# EAGLE design master (EAGLE 5.11)
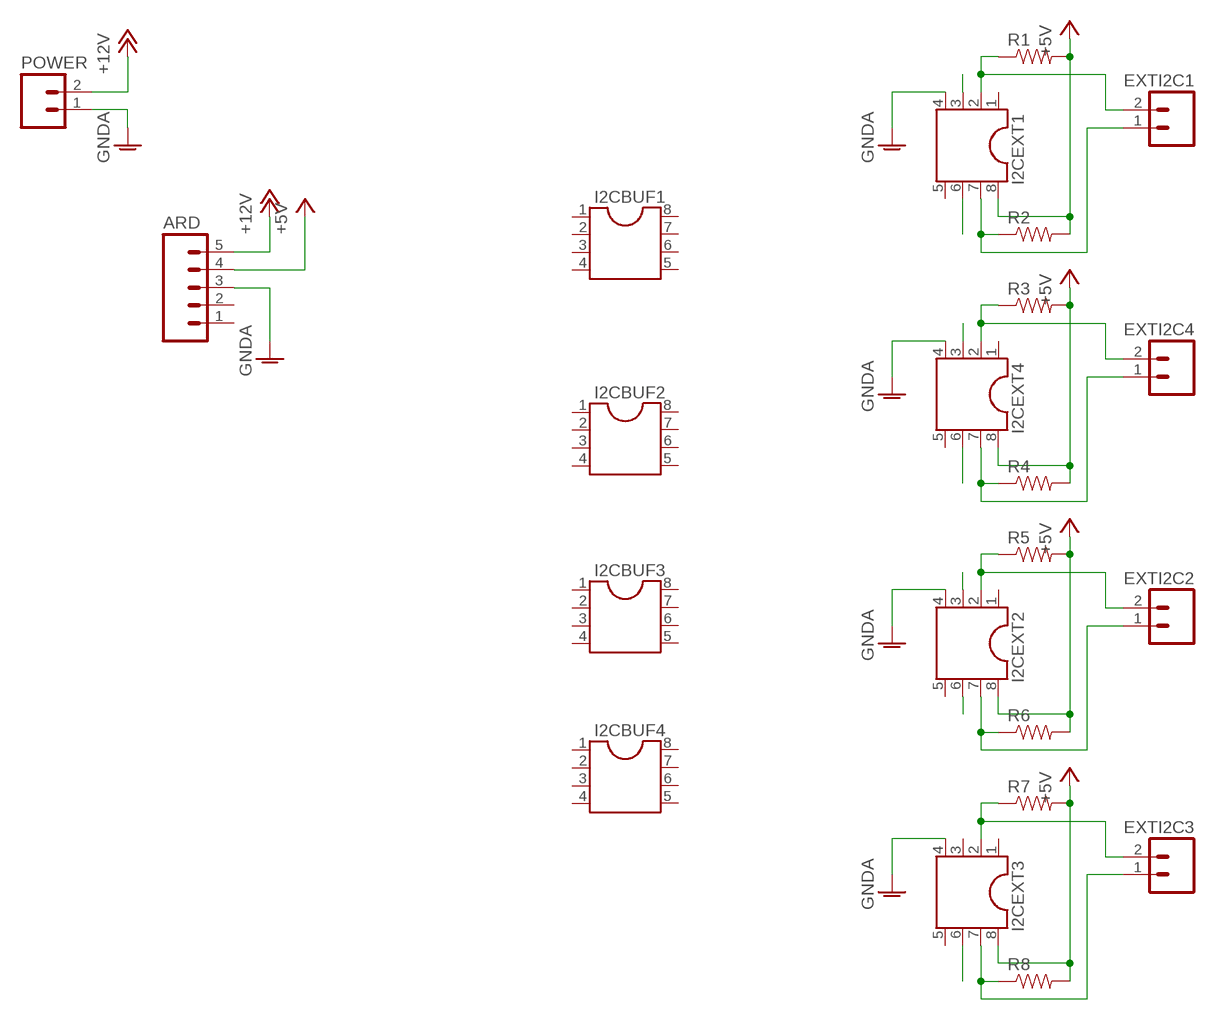
[diagram p0: schematic, sheet 1]

## Parts
ARD  M05LOCK  [1X05_LOCK]
EXTI2C1  M02LOCK  [1X02_LOCK]
EXTI2C2  M02LOCK  [1X02_LOCK]
EXTI2C3  M02LOCK  [1X02_LOCK]
EXTI2C4  M02LOCK  [1X02_LOCK]
I2CBUF1  DIL8  [DIL08]
I2CBUF2  DIL8  [DIL08]
I2CBUF3  DIL8  [DIL08]
I2CBUF4  DIL8  [DIL08]
I2CEXT1  DIL8  [DIL08]
I2CEXT2  DIL8  [DIL08]
I2CEXT3  DIL8  [DIL08]
I2CEXT4  DIL8  [DIL08]
POWER  M02PTH4  [1X02_XTRA_BIG]
R1  RESISTORAXIAL-0.3  [AXIAL-0.3]
R2  RESISTORAXIAL-0.3  [AXIAL-0.3]
R3  RESISTORAXIAL-0.3  [AXIAL-0.3]
R4  RESISTORAXIAL-0.3  [AXIAL-0.3]
R5  RESISTORAXIAL-0.3  [AXIAL-0.3]
R6  RESISTORAXIAL-0.3  [AXIAL-0.3]
R7  RESISTORAXIAL-0.3  [AXIAL-0.3]
R8  RESISTORAXIAL-0.3  [AXIAL-0.3]

## Nets
+5V: ARD.4 I2CEXT1.8 I2CEXT2.8 I2CEXT3.8 I2CEXT4.8 R1.P$2 R2.P$2 R3.P$2 R4.P$2 R5.P$2 R6.P$2 R7.P$2 R8.P$2
+12V: ARD.5 POWER.2
GNDA: ARD.3 I2CEXT1.4 I2CEXT2.4 I2CEXT3.4 I2CEXT4.4 POWER.1
N$1: EXTI2C2.2 I2CEXT2.2 R5.P$1
N$2: EXTI2C2.1 I2CEXT2.7 R6.P$1
N$3: EXTI2C1.2 I2CEXT1.2 R1.P$1
N$4: EXTI2C1.1 I2CEXT1.7 R2.P$1
N$5: EXTI2C4.2 I2CEXT4.2 R3.P$1
N$6: EXTI2C4.1 I2CEXT4.7 R4.P$1
N$7: EXTI2C3.2 I2CEXT3.2 R7.P$1
N$8: EXTI2C3.1 I2CEXT3.7 R8.P$1
N$11: I2CEXT1.6
N$12: I2CEXT1.3
N$13: I2CEXT4.6
N$14: I2CEXT4.3
N$15: I2CEXT2.3
N$16: I2CEXT2.6
N$17: I2CEXT3.6
Unconnected: ARD.1 ARD.2 I2CBUF1.1 I2CBUF1.2 I2CBUF1.3 I2CBUF1.4 I2CBUF1.5 I2CBUF1.6 I2CBUF1.7 I2CBUF1.8 I2CBUF2.1 I2CBUF2.2 I2CBUF2.3 I2CBUF2.4 I2CBUF2.5 I2CBUF2.6 I2CBUF2.7 I2CBUF2.8 I2CBUF3.1 I2CBUF3.2 I2CBUF3.3 I2CBUF3.4 I2CBUF3.5 I2CBUF3.6 I2CBUF3.7 I2CBUF3.8 I2CBUF4.1 I2CBUF4.2 I2CBUF4.3 I2CBUF4.4 I2CBUF4.5 I2CBUF4.6 I2CBUF4.7 I2CBUF4.8 I2CEXT1.1 I2CEXT1.5 I2CEXT2.1 I2CEXT2.5 I2CEXT3.1 I2CEXT3.3 I2CEXT3.5 I2CEXT4.1 I2CEXT4.5

## Library data of the parts
ARD = SparkFun:M05: Header 5 Standard 5-pin 0.1" header. Use with straight break away headers (SKU : PRT-00116), right angle break away headers (PRT-00553), swiss pins (PRT-00743), machine pins (PRT-00117), and female headers (PRT-00115). Molex polarized connector foot print use with SKU : PRT-08230 with associated crimp pins and housings.
EXTI2C1-EXTI2C4 POWER = SparkFun:M02: Header 2 Standard 2-pin 0.1" header. Use with straight break away headers (SKU : PRT-00116), right angle break away headers (PRT-00553), swiss pins (PRT-00743), machine pins (PRT-00117), and female headers (PRT-00115). Molex polarized connector foot print use with SKU : PRT-08233 with associated crimp pins and housings.
I2CBUF1-I2CBUF4 I2CEXT1-I2CEXT4 = ic-package:DIL8: Dual In Line / Socket
R1-R8 = SparkFun:RESISTOR: Resistor Basic schematic elements and footprints for 0603, 1206, and PTH resistors.

## Board
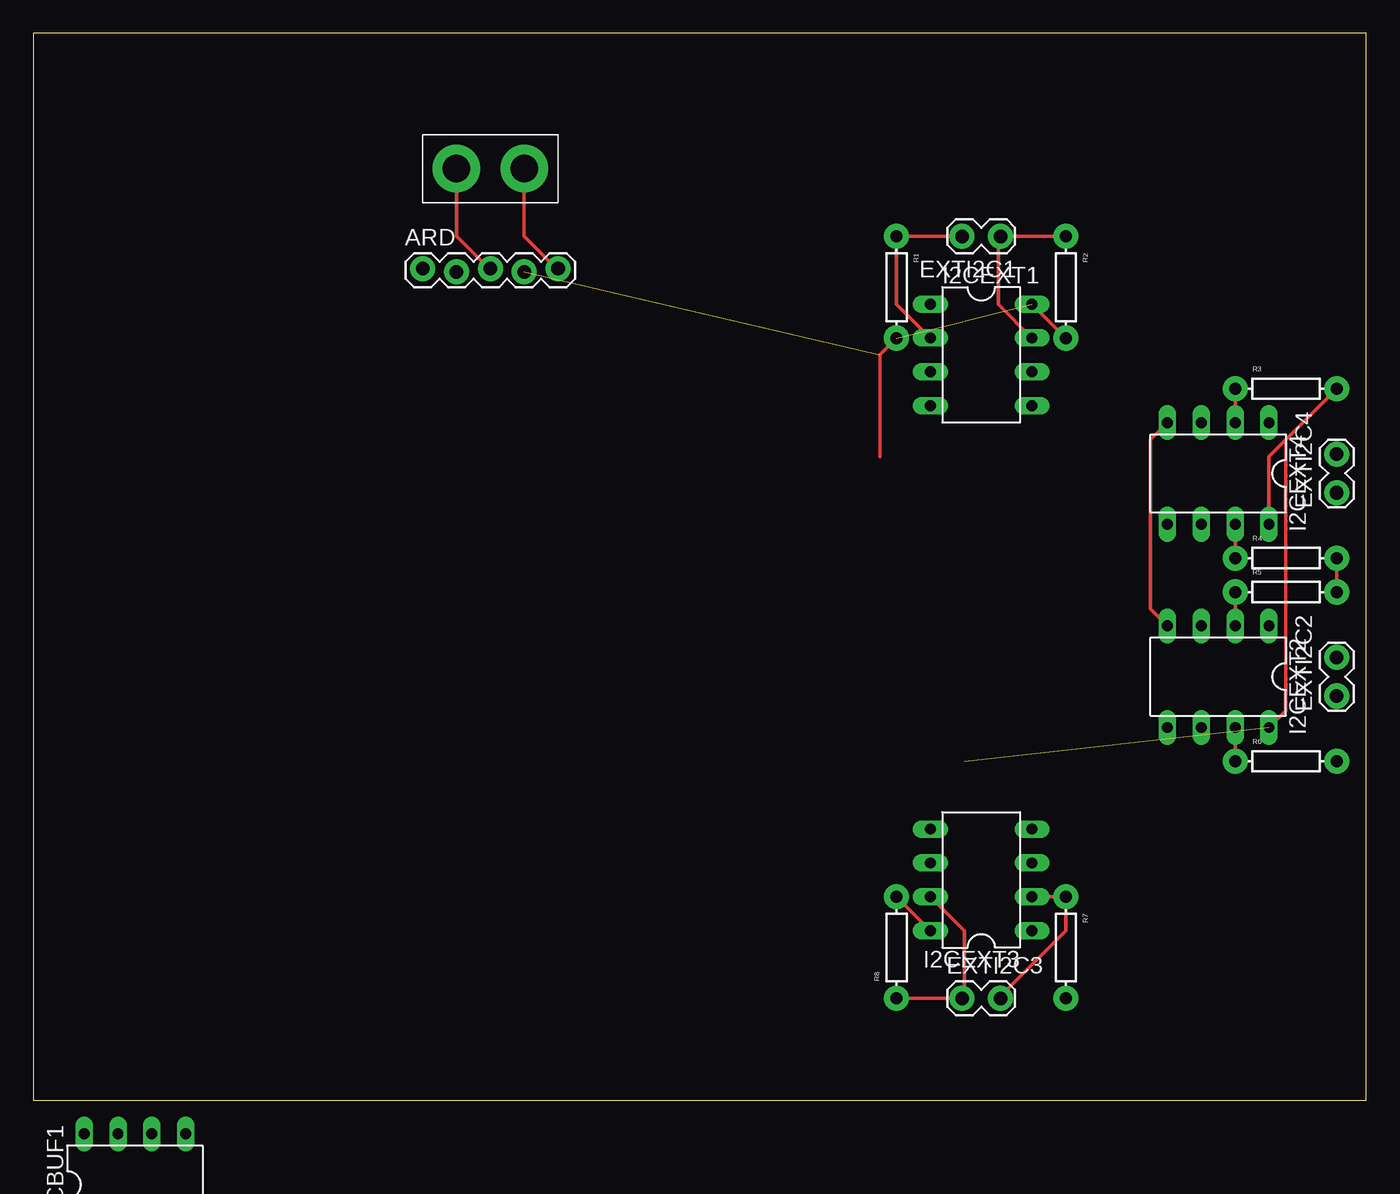
[diagram p1: board, top side]
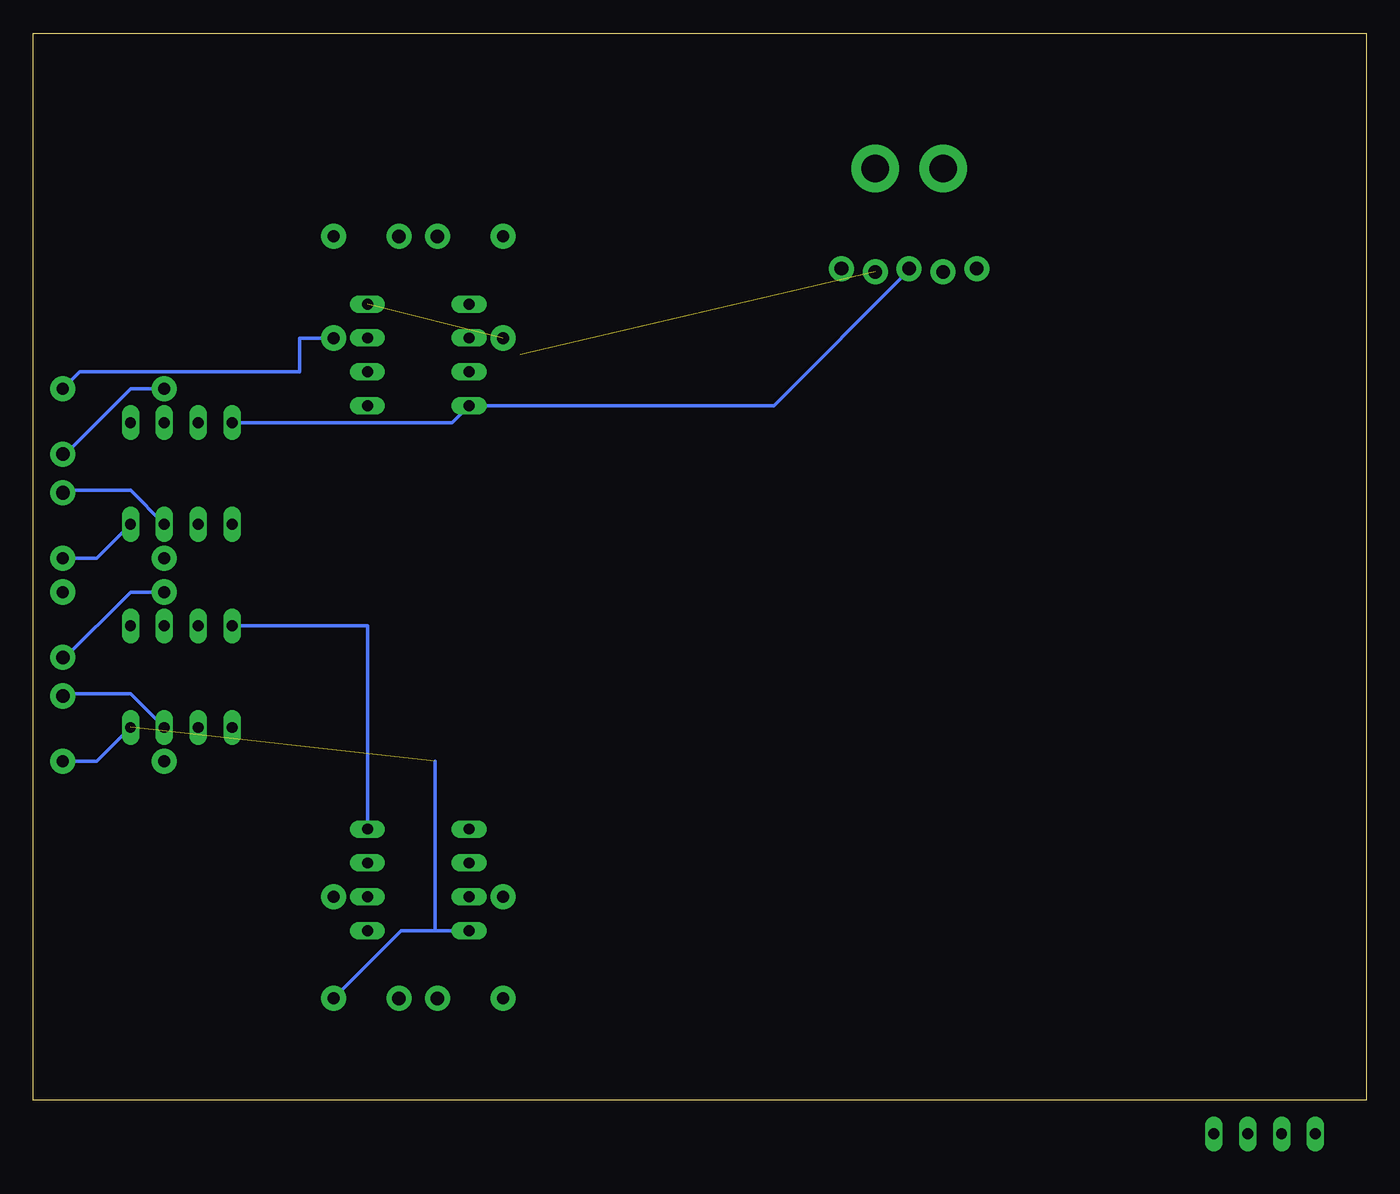
[diagram p2: board, bottom side, seen from below]

Size 100 x 80 mm. Coordinates in mm from the lower left corner, seen from the top.
Outline: 0,0 100,0 100,80 0,80 0,0
Copper layers (1*16): Top 0.035mm / dielectric 1.5mm / Bottom 0.035mm
Design rules "default": minimum track width 10mil, minimum drill 24mil, track to track 8mil, track to pad 8mil, pad to pad 8mil, via to via 8mil, smd to smd 8mil, copper to edge 40mil, drill to drill 8mil, minimum pad ring 10mil, minimum via ring 8mil, stop-mask expansion 4mil, vias tented up to drill 0mil, thermal gap 10mil

### Footprints (pad centres in the part's own frame; a part is rotated, then mirrored left to right if it is on the bottom)
1X05_LOCK = drill 1.016 pad 1.88 round: 1 0,0.127; 2 2.54,-0.127; 3 5.08,0.127; 4 7.62,-0.127; 5 10.16,0.127
1X02_LOCK = drill 1.016 pad 1.88 round: 1 -0.178,0; 2 2.718,0
DIL08 = drill 0.813 long: 1 -3.81,-3.81; 2 -1.27,-3.81; 3 1.27,-3.81; 4 3.81,-3.81; 5 3.81,3.81; 6 1.27,3.81; 7 -1.27,3.81; 8 -3.81,3.81
1X02_XTRA_BIG = drill 2.057 pad 3.556 round: 1 -2.54,0; 2 2.54,0
AXIAL-0.3 = drill 0.9 pad 1.88 round: P$1 -3.81,0; P$2 3.81,0

### Placement (x,y rotation side)
ARD  29.21,62.23 0 top
EXTI2C1  72.39,64.77 180 top
EXTI2C2  97.79,30.48 90 top
EXTI2C3  69.85,7.62 0 top
EXTI2C4  97.79,45.72 90 top
I2CBUF1  7.62,-6.35 0 top
I2CBUF2  7.62,-19.05 0 top  (outside the outline)
I2CBUF3  7.62,-31.75 0 top  (outside the outline)
I2CBUF4  7.62,-44.45 0 top  (outside the outline)
I2CEXT1  71.12,55.88 270 top
I2CEXT2  88.9,31.75 180 top
I2CEXT3  71.12,16.51 90 top
I2CEXT4  88.9,46.99 180 top
POWER  34.29,69.85 0 top
R1  64.77,60.96 270 top
R2  77.47,60.96 270 top
R3  93.98,53.34 0 top
R4  93.98,40.64 0 top
R5  93.98,38.1 0 top
R6  93.98,25.4 0 top
R7  77.47,11.43 270 top
R8  64.77,11.43 90 top

### Tracks (layer width: path | path; a pad name or v marks a point on that pad's centre or on a via)
+5V  (3 unrouted)
  Top 0.254: R4.P$2 R5.P$2 | 93.98,49.53 92.71,48.26 I2CEXT4.8 | 93.98,49.53 R3.P$2 | I2CEXT2.8 93.98,29.21 93.98,49.53 | R8.P$2 I2CEXT3.8 | R2.P$2 I2CEXT1.8 | ARD.4 36.83,62.23 | R1.P$2 63.5,55.88 63.5,53.34 63.5,48.26
  Bottom 0.254: I2CEXT2.8 95.25,25.4 R6.P$2 | I2CEXT4.8 95.25,40.64 R4.P$2 | R7.P$2 72.39,12.7 69.85,12.7 | I2CEXT3.8 69.85,12.7 | R2.P$2 80.01,57.15 80.01,54.61 96.52,54.61 R3.P$2 | 69.85,12.7 69.85,25.4
+12V
  Top 0.254: POWER.2 36.83,64.77 39.37,62.23 ARD.5
GNDA
  Top 0.254: POWER.1 31.75,64.77 34.29,62.23 ARD.3 | I2CEXT4.4 83.82,49.53 83.82,36.83 I2CEXT2.4
  Bottom 0.254: I2CEXT3.4 74.93,35.56 I2CEXT2.4 | I2CEXT4.4 68.58,50.8 I2CEXT1.4 44.45,52.07 34.29,62.23 ARD.3
N$1
  Top 0.254: I2CEXT2.2 R5.P$1
  Bottom 0.254: R5.P$1 92.71,38.1 97.79,33.02 EXTI2C2.2
N$2
  Top 0.254: R6.P$1 I2CEXT2.7
  Bottom 0.254: I2CEXT2.7 92.71,30.48 97.79,30.48 EXTI2C2.1
N$3
  Top 0.254: I2CEXT1.2 64.77,59.69 R1.P$1 EXTI2C1.2 69.85,64.77
N$4
  Top 0.254: I2CEXT1.7 72.39,59.69 72.39,64.77 EXTI2C1.1 R2.P$1
N$5
  Top 0.254: I2CEXT4.2 R3.P$1
  Bottom 0.254: R3.P$1 92.71,53.34 97.79,48.26 EXTI2C4.2
N$6
  Top 0.254: R4.P$1 I2CEXT4.7
  Bottom 0.254: I2CEXT4.7 92.71,45.72 97.79,45.72 EXTI2C4.1
N$7
  Top 0.254: I2CEXT3.2 R7.P$1 77.47,12.7 72.39,7.62 EXTI2C3.2
N$8
  Top 0.254: I2CEXT3.7 69.85,12.7 69.85,7.62 EXTI2C3.1 R8.P$1